# EAGLE schematic module_core_1 (EAGLE 5.10)
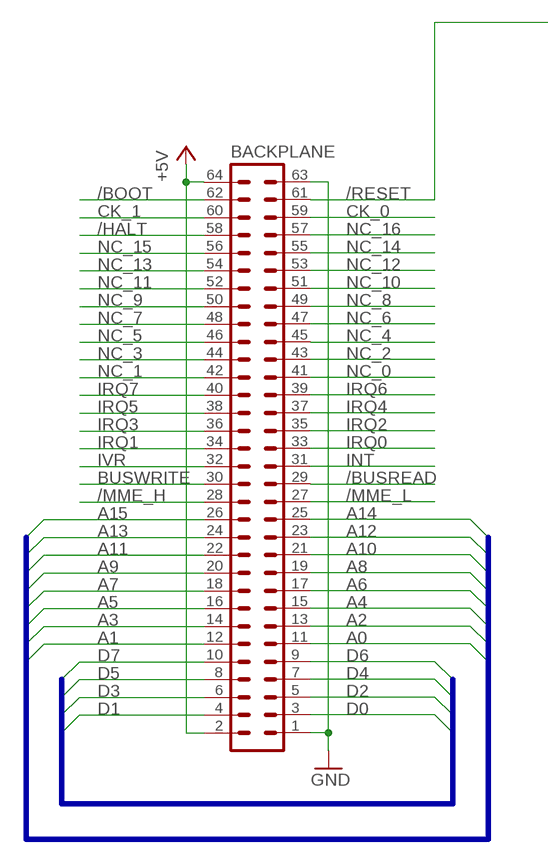
[diagram p0: schematic, sheet 1, part 1 of 2]
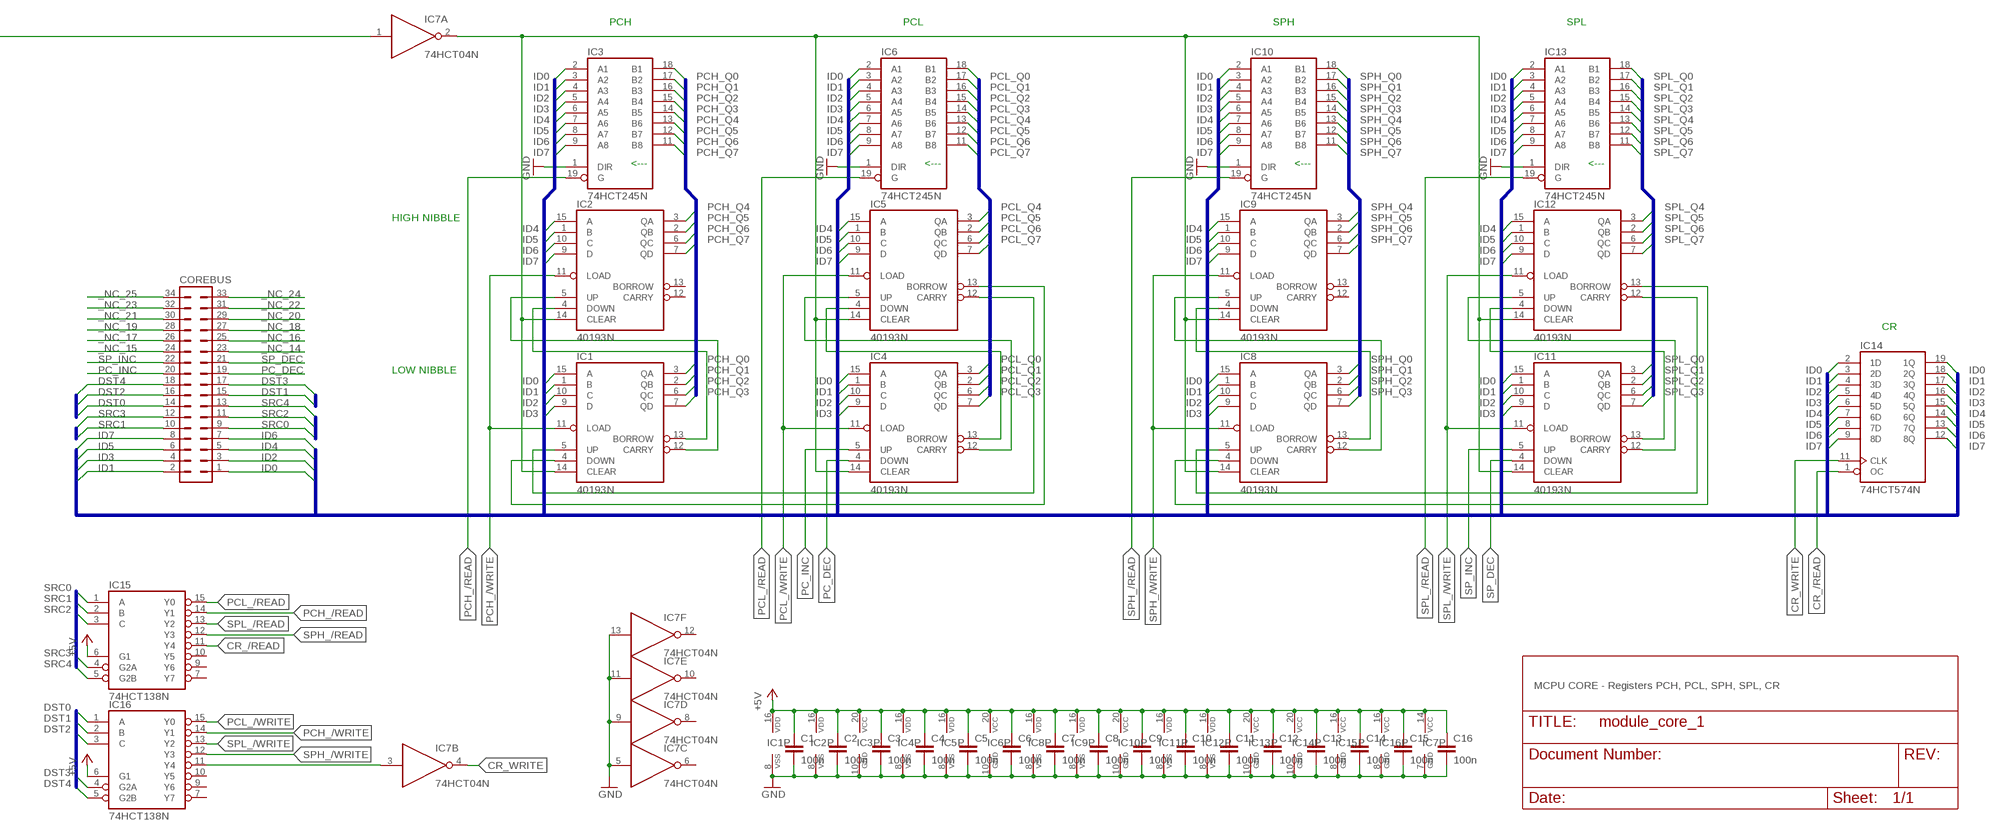
[diagram p1: schematic, sheet 1, part 2 of 2]

## Parts
BACKPLANE  ML64L  [ML64L]
C1  100n  C-EUC1206  [C1206]
C2  100n  C-EUC1206  [C1206]
C3  100n  C-EUC1206  [C1206]
C4  100n  C-EUC1206  [C1206]
C5  100n  C-EUC1206  [C1206]
C6  100n  C-EUC1206  [C1206]
C7  100n  C-EUC1206  [C1206]
C8  100n  C-EUC1206  [C1206]
C9  100n  C-EUC1206  [C1206]
C10  100n  C-EUC1206  [C1206]
C11  100n  C-EUC1206  [C1206]
C12  100n  C-EUC1206  [C1206]
C13  100n  C-EUC1206  [C1206]
C14  100n  C-EUC1206  [C1206]
C15  100n  C-EUC1206  [C1206]
C16  100n  C-EUC1206  [C1206]
COREBUS  ML34L  [ML34L]
IC1  40193N  [DIL16]
IC2  40193N  [DIL16]
IC3  74HCT245N  [DIL20]
IC4  40193N  [DIL16]
IC5  40193N  [DIL16]
IC6  74HCT245N  [DIL20]
IC7  74HCT04N  [DIL14]
IC8  40193N  [DIL16]
IC9  40193N  [DIL16]
IC10  74HCT245N  [DIL20]
IC11  40193N  [DIL16]
IC12  40193N  [DIL16]
IC13  74HCT245N  [DIL20]
IC14  74HCT574N  [DIL20]
IC15  74HCT138N  [DIL16]
IC16  74HCT138N  [DIL16]

## Nets
+5V: BACKPLANE.2 BACKPLANE.64 C1.1 C2.1 C3.1 C4.1 C5.1 C6.1 C7.1 C8.1 C9.1 C10.1 C11.1 C12.1 C13.1 C14.1 C15.1 C16.1 IC1.16(VDD) IC2.16(VDD) IC3.20(VCC) IC4.16(VDD) IC5.16(VDD) IC6.20(VCC) IC7.14(P:VCC) IC8.16(VDD) IC9.16(VDD) IC10.20(VCC) IC11.16(VDD) IC12.16(VDD) IC13.20(VCC) IC14.20(VCC) IC15.6(G1) IC15.16(VCC) IC16.6(G1) IC16.16(VCC)
/BOOT: BACKPLANE.62
/BUSREAD: BACKPLANE.29
/HALT: BACKPLANE.58
/MME_H: BACKPLANE.28
/MME_L: BACKPLANE.27
/RESET: BACKPLANE.61 IC7.1(A:I)
_NC_14: COREBUS.23
_NC_15: COREBUS.24
_NC_16: COREBUS.25
_NC_17: COREBUS.26
_NC_18: COREBUS.27
_NC_19: COREBUS.28
_NC_20: COREBUS.29
_NC_21: COREBUS.30
_NC_22: COREBUS.31
_NC_23: COREBUS.32
_NC_24: COREBUS.33
_NC_25: COREBUS.34
A0: BACKPLANE.11
A1: BACKPLANE.12
A2: BACKPLANE.13
A3: BACKPLANE.14
A4: BACKPLANE.15
A5: BACKPLANE.16
A6: BACKPLANE.17
A7: BACKPLANE.18
A8: BACKPLANE.19
A9: BACKPLANE.20
A10: BACKPLANE.21
A11: BACKPLANE.22
A12: BACKPLANE.23
A13: BACKPLANE.24
A14: BACKPLANE.25
A15: BACKPLANE.26
BUSWRITE: BACKPLANE.30
CK_0: BACKPLANE.59
CK_1: BACKPLANE.60
CR_/READ: IC14.1(OC) IC15.11(Y4)
CR_WRITE: IC7.4(B:O) IC14.11(CLK)
D0: BACKPLANE.3
D1: BACKPLANE.4
D2: BACKPLANE.5
D3: BACKPLANE.6
D4: BACKPLANE.7
D5: BACKPLANE.8
D6: BACKPLANE.9
D7: BACKPLANE.10
DST0: COREBUS.14 IC16.1(A)
DST1: COREBUS.15 IC16.2(B)
DST2: COREBUS.16 IC16.3(C)
DST3: COREBUS.17 IC16.4(G2A)
DST4: COREBUS.18 IC16.5(G2B)
GND: BACKPLANE.1 BACKPLANE.63 C1.2 C2.2 C3.2 C4.2 C5.2 C6.2 C7.2 C8.2 C9.2 C10.2 C11.2 C12.2 C13.2 C14.2 C15.2 C16.2 IC1.8(VSS) IC2.8(VSS) IC3.1(DIR) IC3.10(GND) IC4.8(VSS) IC5.8(VSS) IC6.1(DIR) IC6.10(GND) IC7.5(C:I) IC7.7(P:GND) IC7.9(D:I) IC7.11(E:I) IC7.13(F:I) IC8.8(VSS) IC9.8(VSS) IC10.1(DIR) IC10.10(GND) IC11.8(VSS) IC12.8(VSS) IC13.1(DIR) IC13.10(GND) IC14.10(GND) IC15.8(GND) IC16.8(GND)
ID0: COREBUS.1 IC1.15(A) IC3.2(A1) IC4.15(A) IC6.2(A1) IC8.15(A) IC10.2(A1) IC11.15(A) IC13.2(A1) IC14.2(1D) IC14.19(1Q)
ID1: COREBUS.2 IC1.1(B) IC3.3(A2) IC4.1(B) IC6.3(A2) IC8.1(B) IC10.3(A2) IC11.1(B) IC13.3(A2) IC14.3(2D) IC14.18(2Q)
ID2: COREBUS.3 IC1.10(C) IC3.4(A3) IC4.10(C) IC6.4(A3) IC8.10(C) IC10.4(A3) IC11.10(C) IC13.4(A3) IC14.4(3D) IC14.17(3Q)
ID3: COREBUS.4 IC1.9(D) IC3.5(A4) IC4.9(D) IC6.5(A4) IC8.9(D) IC10.5(A4) IC11.9(D) IC13.5(A4) IC14.5(4D) IC14.16(4Q)
ID4: COREBUS.5 IC2.15(A) IC3.6(A5) IC5.15(A) IC6.6(A5) IC9.15(A) IC10.6(A5) IC12.15(A) IC13.6(A5) IC14.6(5D) IC14.15(5Q)
ID5: COREBUS.6 IC2.1(B) IC3.7(A6) IC5.1(B) IC6.7(A6) IC9.1(B) IC10.7(A6) IC12.1(B) IC13.7(A6) IC14.7(6D) IC14.14(6Q)
ID6: COREBUS.7 IC2.10(C) IC3.8(A7) IC5.10(C) IC6.8(A7) IC9.10(C) IC10.8(A7) IC12.10(C) IC13.8(A7) IC14.8(7D) IC14.13(7Q)
ID7: COREBUS.8 IC2.9(D) IC3.9(A8) IC5.9(D) IC6.9(A8) IC9.9(D) IC10.9(A8) IC12.9(D) IC13.9(A8) IC14.9(8D) IC14.12(8Q)
INT: BACKPLANE.31
IRQ0: BACKPLANE.33
IRQ1: BACKPLANE.34
IRQ2: BACKPLANE.35
IRQ3: BACKPLANE.36
IRQ4: BACKPLANE.37
IRQ5: BACKPLANE.38
IRQ6: BACKPLANE.39
IRQ7: BACKPLANE.40
IVR: BACKPLANE.32
N$1: IC1.13(BORROW) IC2.4(DOWN)
N$2: IC1.12(CARRY) IC2.5(UP)
N$5: IC8.13(BORROW) IC9.4(DOWN)
N$6: IC8.12(CARRY) IC9.5(UP)
N$7: IC4.13(BORROW) IC5.4(DOWN)
N$8: IC4.12(CARRY) IC5.5(UP)
N$9: IC1.5(UP) IC5.12(CARRY)
N$10: IC1.4(DOWN) IC5.13(BORROW)
N$11: IC11.13(BORROW) IC12.4(DOWN)
N$12: IC11.12(CARRY) IC12.5(UP)
N$13: IC8.5(UP) IC12.12(CARRY)
N$14: IC8.4(DOWN) IC12.13(BORROW)
N$17: IC7.3(B:I) IC16.11(Y4)
NC_0: BACKPLANE.41
NC_1: BACKPLANE.42
NC_2: BACKPLANE.43
NC_3: BACKPLANE.44
NC_4: BACKPLANE.45
NC_5: BACKPLANE.46
NC_6: BACKPLANE.47
NC_7: BACKPLANE.48
NC_8: BACKPLANE.49
NC_9: BACKPLANE.50
NC_10: BACKPLANE.51
NC_11: BACKPLANE.52
NC_12: BACKPLANE.53
NC_13: BACKPLANE.54
NC_14: BACKPLANE.55
NC_15: BACKPLANE.56
NC_16: BACKPLANE.57
PC_DEC: COREBUS.19 IC4.4(DOWN)
PC_INC: COREBUS.20 IC4.5(UP)
PCH_/READ: IC3.19(G) IC15.14(Y1)
PCH_/WRITE: IC1.11(LOAD) IC2.11(LOAD) IC16.14(Y1)
PCH_Q0: IC1.3(QA) IC3.18(B1)
PCH_Q1: IC1.2(QB) IC3.17(B2)
PCH_Q2: IC1.6(QC) IC3.16(B3)
PCH_Q3: IC1.7(QD) IC3.15(B4)
PCH_Q4: IC2.3(QA) IC3.14(B5)
PCH_Q5: IC2.2(QB) IC3.13(B6)
PCH_Q6: IC2.6(QC) IC3.12(B7)
PCH_Q7: IC2.7(QD) IC3.11(B8)
PCL_/READ: IC6.19(G) IC15.15(Y0)
PCL_/WRITE: IC4.11(LOAD) IC5.11(LOAD) IC16.15(Y0)
PCL_Q0: IC4.3(QA) IC6.18(B1)
PCL_Q1: IC4.2(QB) IC6.17(B2)
PCL_Q2: IC4.6(QC) IC6.16(B3)
PCL_Q3: IC4.7(QD) IC6.15(B4)
PCL_Q4: IC5.3(QA) IC6.14(B5)
PCL_Q5: IC5.2(QB) IC6.13(B6)
PCL_Q6: IC5.6(QC) IC6.12(B7)
PCL_Q7: IC5.7(QD) IC6.11(B8)
RESET: IC1.14(CLEAR) IC2.14(CLEAR) IC4.14(CLEAR) IC5.14(CLEAR) IC7.2(A:O) IC8.14(CLEAR) IC9.14(CLEAR) IC11.14(CLEAR) IC12.14(CLEAR)
SP_DEC: COREBUS.21 IC11.4(DOWN)
SP_INC: COREBUS.22 IC11.5(UP)
SPH_/READ: IC10.19(G) IC15.12(Y3)
SPH_/WRITE: IC8.11(LOAD) IC9.11(LOAD) IC16.12(Y3)
SPH_Q0: IC8.3(QA) IC10.18(B1)
SPH_Q1: IC8.2(QB) IC10.17(B2)
SPH_Q2: IC8.6(QC) IC10.16(B3)
SPH_Q3: IC8.7(QD) IC10.15(B4)
SPH_Q4: IC9.3(QA) IC10.14(B5)
SPH_Q5: IC9.2(QB) IC10.13(B6)
SPH_Q6: IC9.6(QC) IC10.12(B7)
SPH_Q7: IC9.7(QD) IC10.11(B8)
SPL_/READ: IC13.19(G) IC15.13(Y2)
SPL_/WRITE: IC11.11(LOAD) IC12.11(LOAD) IC16.13(Y2)
SPL_Q0: IC11.3(QA) IC13.18(B1)
SPL_Q1: IC11.2(QB) IC13.17(B2)
SPL_Q2: IC11.6(QC) IC13.16(B3)
SPL_Q3: IC11.7(QD) IC13.15(B4)
SPL_Q4: IC12.3(QA) IC13.14(B5)
SPL_Q5: IC12.2(QB) IC13.13(B6)
SPL_Q6: IC12.6(QC) IC13.12(B7)
SPL_Q7: IC12.7(QD) IC13.11(B8)
SRC0: COREBUS.9 IC15.1(A)
SRC1: COREBUS.10 IC15.2(B)
SRC2: COREBUS.11 IC15.3(C)
SRC3: COREBUS.12 IC15.4(G2A)
SRC4: COREBUS.13 IC15.5(G2B)
Unconnected: IC2.12(CARRY) IC2.13(BORROW) IC7.6(C:O) IC7.8(D:O) IC7.10(E:O) IC7.12(F:O) IC9.12(CARRY) IC9.13(BORROW) IC15.7(Y7) IC15.9(Y6) IC15.10(Y5) IC16.7(Y7) IC16.9(Y6) IC16.10(Y5)

## Buses
D[0..7]
A[0..15]
ID[0..7]
PCH_Q[0..7]
PCL_Q[0..7]
SPH_Q[0..7]
SPL_Q[0..7]
DST[0..4]
SRC[0..4]

## Notes on the sheet
- PCH | PCL | SPH | SPL
- <--- | <--- | <--- | <---
- HIGH NIBBLE
- CR
- LOW NIBBLE
- MCPU CORE - Registers PCH, PCL, SPH, SPL, CR

## Library data of the parts
BACKPLANE = con-ml:ML64L: HARTING
C1-C16 = rcl:C-EU: CAPACITOR, European symbol
COREBUS = con-ml:ML34L: HARTING
IC1 IC2 IC4 IC5 IC8 IC9 IC11 IC12 = 40xx:40193: Binary up down COUNTER
IC3 IC6 IC10 IC13 = 74xx-eu:74*245: Octal BUS TRANSCEIVER, 3-state
IC7 = 74xx-eu:74*04: Hex INVERTER
IC14 = 74xx-eu:74*574: 8-bit D type FLIP FLOP bus driver
IC15 IC16 = 74xx-eu:74*138: 3-line to 8-line DECODER/DEMULTIPLEXER

## Net classes
0 Signal: width 0.305 mm, drill 0.508 mm, clearance 0.203 mm
1 LoVolt42: width 0.61 mm, drill 0.508 mm, clearance 0.813 mm to class 0, clearance 0.305 mm
2 MedVolt100: width 0.61 mm, drill 0.508 mm, clearance 1.626 mm to class 0, clearance 1.626 mm to class 1, clearance 0.813 mm
3 LineVolt350: width 0.813 mm, drill 0.508 mm, clearance 12.7 mm to class 0, clearance 12.7 mm to class 1, clearance 12.7 mm to class 2, clearance 2.54 mm